# Altium schematic sheet MZ.SchDoc
size A
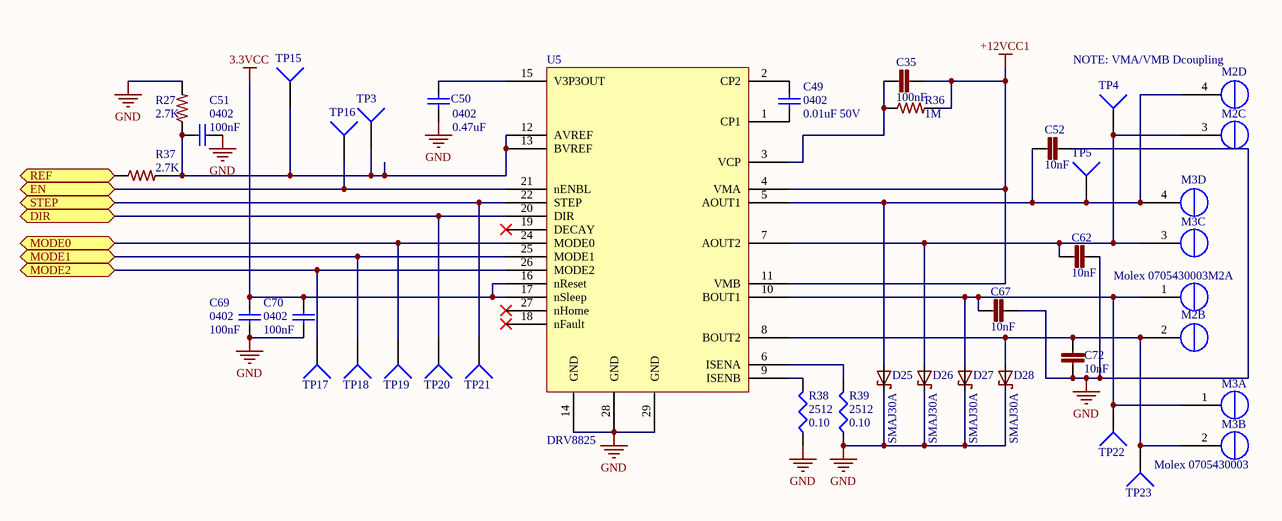
[diagram p0: MZ.SchDoc]

## Parts
C35  100nF  [C0603]
C49  value 0.01uF 50V  [C0402]  (hidden comment: 0402)
C50  value 0.47uF  [C0402]  (hidden comment: 0402)
C51  value 100nF  [C0402]  (hidden comment: 0402)
C52  10nF  [C0603]
C62  10nF  [C0603]
C67  10nF  [C0603]
C69  value 100nF  [C0402]  (hidden comment: 0402)
C70  value 100nF  [C0402]  (hidden comment: 0402)
C72  10nF  [C0603]
D25  SMAJ30A  [SMA-SM]
D26  SMAJ30A  [SMA-SM]
D27  SMAJ30A  [SMA-SM]
D28  SMAJ30A  [SMA-SM]
M2  Molex 0705430003  [4POL254]  (parts A,B,C,D of 4)
M3  Molex 0705430003  [4POL254]  (parts A,B,C,D of 4)
R27  2.7K  [R0402]
R36  1M  [R0402]
R37  2.7K  [R0402]
R38  2512  value 0.10  [2512R-0.55]
R39  2512  value 0.10  [2512R-0.55]
TP3  TP4  [TP-2]  (value not drawn)
TP4  TP4  [TP-2]  (value not drawn)
TP5  TP4  [TP-2]  (value not drawn)
TP15  TP4  [TP-2]  (value not drawn)
TP16  TP4  [TP-2]  (value not drawn)
TP17  TP4  [TP-2]  (value not drawn)
TP18  TP4  [TP-2]  (value not drawn)
TP19  TP4  [TP-2]  (value not drawn)
TP20  TP4  [TP-2]  (value not drawn)
TP21  TP4  [TP-2]  (value not drawn)
TP22  TP4  [TP-2]  (value not drawn)
TP23  TP4  [TP-2]  (value not drawn)
U5  DRV8825  [DRV8825PWPR]

## Ports
DIR, EN, MODE0, MODE1, MODE2, REF, STEP

## Nets
3.3VCC: C69.2 C70.2 U5.16(nReset) U5.17(nSleep)
+12VCC1: C35.2 R36.2 U5.4(VMA) U5.11(VMB)
GND: C50.1 C51.1 C52.2 C62.2 C67.2 C69.1 C70.1 C72.1 D25.C D26.C D27.C D28.C R27.2 R38.1 R39.1 U5.14(GND) U5.28(GND) U5.29(GND)
DIR: TP20.1 U5.20(DIR) ; port DIR
EN: TP16.1 U5.21(nENBL) ; port EN
MODE0: TP19.1 U5.24(MODE0) ; port MODE0
MODE1: TP18.1 U5.25(MODE1) ; port MODE1
MODE2: TP17.1 U5.26(MODE2) ; port MODE2
REF: R37.1 ; port REF
STEP: TP21.1 U5.22(STEP) ; port STEP
NetC35_1: C35.1 R36.1 U5.3(VCP)
NetC49_1: C49.1 U5.1(CP1)
NetC49_2: C49.2 U5.2(CP2)
NetC50_2: C50.2 U5.15(V3P3OUT)
NetC51_2: C51.2 R27.1 R37.2 TP3.1 TP15.1 U5.12(AVREF) U5.13(BVREF)
NetC52_1: C52.1 D25.A M2.4(OUT1B) M3.4(OUT1B) TP5.1 U5.5(AOUT1)
NetC62_1: C62.1 D26.A M2.3(OUT1A) M3.3(OUT1A) TP4.1 U5.7(AOUT2)
NetC67_1: C67.1 D27.A M2.1(OUT2B) M3.1(OUT2B) TP22.1 U5.10(BOUT1)
NetC72_2: C72.2 D28.A M2.2(OUT2A) M3.2(OUT2A) TP23.1 U5.8(BOUT2)
NetR38_2: R38.2 U5.9(ISENB)
NetR39_2: R39.2 U5.6(ISENA)

Not connected (* = marked no-connect by the designer): U5 18(nFault)* 19(DECAY)* 23(NC) 27(nHome)*

## Notes on the sheet
- NOTE: VMA/VMB Dcoupling

## Library data of the parts
C35 = C0603C104K5RACTU: CAP CER 0603 100nF 50V 10% X7R; LastRevisionNote: ImportComponents; Published: 23-Apr-2014; Publisher: UltiMachine; LastRevisionDate: 23-Apr-2014; ManufacturerPartNumber: C0603C104K5RACTU; VALUE: 100nF
C49 = GRM155R71H103JA88D: CAP CER 10000PF 50V X7R 0402; MFR: Murata; Tolerance: 10%; Voltage: 6.3VDC; Published: 10 - Dec - 2014; LatestRevisionDate: 10 - Dec - 2014; LatestRevisionNote: Ultimachine Footprint Added; Publisher: Ultimachine; Component Type: Chip Capacitor; MFR Part #: GRM155R71H103JA88D; Part Description: CAP CER 10000PF 50V X7R 0402; Mounting Type: SMT 0402; Datasheet: http://search.murata.co.jp/Ceramy/image/img/A01X/G101/ENG/GRM155R71H103JA88-01.pdf; Height: 0.5 ±0.05mm; Digikey #: 490-7763-1-ND; PackageReference: 0402
C50 = GRM155R60J474KE19D: 0.47uF 6.3v C0402 - GRM155R60J474KE19D; MFR: Murata; Part Description: CAP CER 0.47UF 6.3V 10% X5R 0402; Tolerance: 10%; Voltage: 6.3VDC; Published: 10 - Dec - 2014; LatestRevisionDate: 10 - Dec - 2014; LatestRevisionNote: Ultimachine Footprint Added; Publisher: Ultimachine; Component Type: Chip Capacitor; MFR Part #: GRM155R60J474KE19D; Mounting Type: SMT 0402; Datasheet: http://search.murata.co.jp/Ceramy/image/img/A01X/G101/ENG/GRM155R60J474KE19-01.pdf; Height: 0.5 ±0.05mm; PackageReference: 0402
C51 C69 C70 = 100nF C0402 - GRM155R71C104KA88D: Capacitor (Semiconductor SIM Model); MFR: Murata; Part Description: CAP CER 0.1UF 16V 10% X7R 0402; Tolerance: 10%; Voltage: 16v; Published: 10 - Dec - 2014; LatestRevisionDate: 10 - Dec - 2014; LatestRevisionNote: Ultimachine Footprint Added; Publisher: Ultimachine; Component Type: Chip Capacitor; MFR Part #: GRM155R71C104KA88D; Mounting Type: SMT 0402; Datasheet: http://psearch.murata.com/capacitor/product/GRM155R71C104KA88%23.pdf; Height: 0.5 ±0.05mm; PackageReference: 0402
C52 C62 C67 C72 = C1608X7R1E103K080AA: CAP CER 0603 10nF 25V 10% X7R; LastRevisionNote: ImportComponents; Published: 23-Apr-2014; Publisher: UltiMachine; LastRevisionDate: 23-Apr-2014; ManufacturerPartNumber: C1608X7R1E103K080AA; VALUE: 10nF
D25-D28 = SMAJ30A: DIODE TVS 30V SMA; LastRevisionNote: ImportComponents; Published: 23-Apr-2014; Publisher: UltiMachine; LastRevisionDate: 23-Apr-2014; ManufacturerPartNumber: SMAJ30A
M2 M3 = Molex 0705430003 Alt: Molex 4 Pin Clip Connector
R27 R37 = ERJ-2RKF2701X: RES SMD 2.7K OHM 1% 1/10W 0402; Manufacturer: Panasonic; ManufacturerPartNumber: ERJ2GEJ105X; LastRevisionNote: ImportComponents; Published: 23-Apr-2014; Publisher: Adam; LastRevisionDate: 23-Apr-2014; VALUE: 2.7K
R36 = ERJ2GEJ105X: RES 0402 1M 100mW 5%; LastRevisionNote: ImportComponents; Published: 23-Apr-2014; Publisher: UltiMachine; LastRevisionDate: 23-Apr-2014; ManufacturerPartNumber: ERJ2GEJ105X; VALUE: 1M
R38 R39 = CSRN2512FTR100: RES SMD 0.1 OHM 1% 2W 2512; MFR: Stackpole ELectronics Inc; PackageReference: 2512; MFR #: CSRN2512FTR100; Digikey #: CSRN2512FTR100TR-ND; PDF: http://www.seielect.com/catalog/SEI-CSR_CSRN.pdf
TP3-TP5 TP15-TP23 = Socket: LatestRevisionDate: 17-Jul-2002; LatestRevisionNote: Re-released for DXP Platform.; Publisher: Altium Limited
U5 = DRV8825: DRV8825 Ti Stepper Driver; Manufacture: Texas Instruments; Mountining Type: SMD - Ti PowerPAD Package; Voltage: 8.2-45VDC; Cost (1000 qty): 2.25; Part Number: DRV8825PWPR; Status: In-Production; Pins: 28 Pins and one Exposed Pad; Datasheet: http://www.ti.com/lit/gpn/drv8825; Height: 1.2mm; Tolerance: N/A; Type: Stepper Driver - Integrated Circuit; Lead Free: YES